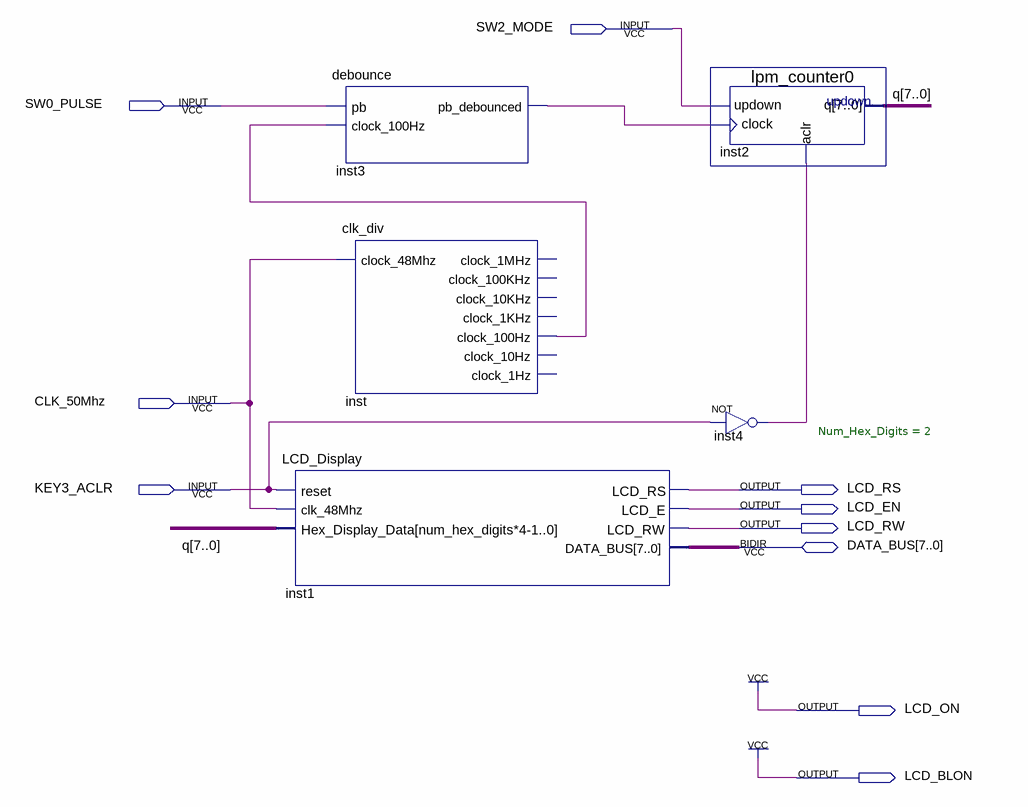
[diagram p0: schematic sheet]
// Quartus schematic tutor3.bdf as structural Verilog: 5 symbols, 10 pins
module tutor3 (
  input  SW2_MODE,
  input  SW0_PULSE,
  input  CLK_50Mhz,
  input  KEY3_ACLR,
  inout  [7:0] DATA_BUS,
  output LCD_RS,
  output LCD_EN,
  output LCD_RW,
  output LCD_ON,
  output LCD_BLON
);

  wire inst3_pb_debounced, inst4_out, inst_clock_100hz;
  wire [7:0] q;

  debounce inst3 (.pb(SW0_PULSE), .clock_100Hz(inst_clock_100hz), .pb_debounced(inst3_pb_debounced));
  clk_div inst (
    .clock_48Mhz(CLK_50Mhz), .clock_100Hz(inst_clock_100hz));  // open: clock_1MHz, clock_100KHz, clock_10KHz, clock_1KHz, clock_10Hz, clock_1Hz
  LCD_Display #(.Num_Hex_Digits(2)) inst1 (
    .reset(KEY3_ACLR), .clk_48Mhz(CLK_50Mhz), .Hex_Display_Data(q), .LCD_RS(LCD_RS), .LCD_E(LCD_EN),
    .LCD_RW(LCD_RW), .DATA_BUS(DATA_BUS));
  lpm_counter0 inst2 (.updown(SW2_MODE), .clock(inst3_pb_debounced), .aclr(inst4_out), .q(q));
  not inst4 (inst4_out, KEY3_ACLR);

  assign LCD_BLON = 1'b1;
  assign LCD_ON = 1'b1;
endmodule
